# Altium schematic sheet IO_Peripherals.SchDoc
size A; SheetNumber: 7; SheetTotal: 7
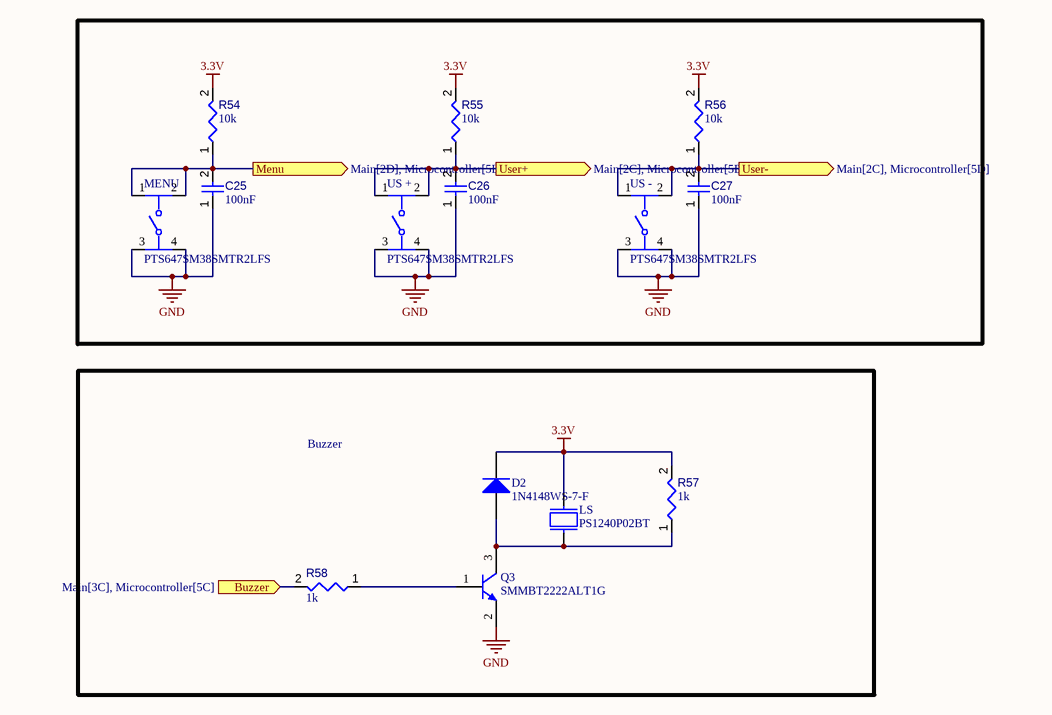
[diagram p0: IO_Peripherals.SchDoc]

## Parts
C25  value 100nF  [CAPC2013X95X50LL10T25]  (hidden comment: Capacitor 100 nF +/-10% 50 V 0805)
C26  value 100nF  [CAPC2013X95X50LL10T25]  (hidden comment: Capacitor 100 nF +/-10% 50 V 0805)
C27  value 100nF  [CAPC2013X95X50LL10T25]  (hidden comment: Capacitor 100 nF +/-10% 50 V 0805)
D2  1N4148WS-7-F  [DIOD-SOD323-2-A_V]
LS  PS1240P02BT  [XDCR_PS1240P02BT]
MENU  PTS647SM38SMTR2LFS  [FP-PTS647SM38SMTR2LFS-MFG]
Q3  SMMBT2222ALT1G  [ONSC-SOT-23-3-318-08_V]
R54  value 10k  [RESC2013X50X35ML15T15]  (hidden comment: Resistor 10k +/-1% 0805 125 mW)
R55  value 10k  [RESC2013X50X35ML15T15]  (hidden comment: Resistor 10k +/-1% 0805 125 mW)
R56  value 10k  [RESC2013X50X35ML15T15]  (hidden comment: Resistor 10k +/-1% 0805 125 mW)
R57  value 1k  [RESC0805(2012)_L]  (hidden comment: Resistor 1K +/-5% 0805 125 mW)
R58  value 1k  [RESC0805(2012)_L]  (hidden comment: Resistor 1K +/-5% 0805 125 mW)
US_+  PTS647SM38SMTR2LFS  [FP-PTS647SM38SMTR2LFS-MFG]
US_-  PTS647SM38SMTR2LFS  [FP-PTS647SM38SMTR2LFS-MFG]

## Blocks framed on the sheet
Buzzer: D2 LS Q3 R57 R58

## Ports
Buzzer (in, see Main[3C], Microcontroller[5C]), Menu (out, see Main[2D], Microcontroller[5D]), User+ (out, see Main[2C], Microcontroller[5D]), User- (out, see Main[2C], Microcontroller[5D])

## Nets
3.3V: D2.2(K) LS.2 R54.2 R55.2 R56.2 R57.2
GND: C25.1 C26.1 C27.1 MENU.3 MENU.4 Q3.2(E) US_+.3 US_+.4 US_-.3 US_-.4
Buzzer: R58.2 ; port Buzzer
Menu: C25.2 MENU.1 MENU.2 R54.1 ; port Menu
User+: C26.2 R55.1 US_+.1 US_+.2 ; port User+
User-: C27.2 R56.1 US_-.1 US_-.2 ; port User-
NetD2_1: D2.1(A) LS.1 Q3.3(C) R57.1
NetQ3_1: Q3.1(B) R58.1

## Library data of the parts
C25-C27 = CMP-001-00018-6: Chip Capacitor, 100 nF, +/- 10%, 50 V, 0805 (2012 Metric); Capacitor Type: Ceramic; Voltage Rating: 50V; Pins: 2; Max Operating Temperature: 125°C; Min Operating Temperature: -55°C; Mounting Technology: SM; Case/Package: 0805; RoHS Compliant: True; Tolerance: 10%
D2 = CMP-004-00034-1: Rectifier Diode Small Signal Switching 75V 0.3A 4ns 2-Pin SOD-323 T/R; Max Surge Current: 2A; Forward Voltage: 715mV; Max Operating Temperature: 150°C; Mounting Technology: Surface Mount; Pins: 2; Min Operating Temperature: -65°C
LS = CMP-025-000000-1: Buzzers Transducer, Externally Driven Piezo 3V 4kHz 60dB @ 3V, 10cm Through Hole PC Pins; MF: TDK; Availability: Unavailable; Value: *; MP: PS1240P02BT; Price: None; Component Type: Standard; Package: 2020 TDK; SnapEDA_Link: https://www.snapeda.com/parts/PS1240P02BT/TDK/view-part/53420/?ref=snap; Design Item ID: PS1240P02BT; Pin Count: 2; Source: SnapEDAsch.SchLib; Manufacturer Part Number 1: PS1240P02BT
MENU US_+ US_- = CMP-011-00014-1: Switch Tactile OFF Mom SPST Round Button Gull Wing 50mA 12VDC 100000Cycles 1.77N Surface Mount T/R; Mounting Technology: Surface Mount; Max Operating Temperature: 70°C; Min Operating Temperature: -40°C; Max Current Rating: 50mA; Throw Configuration: SPST
Q3 = CMP-1048-00591-1: General Purpose Transistor, NPN Silicon, 3-Pin SOT-23, Pb-Free, Tape and Reel; Manufacturer: On Semiconductor; fT Min (MHz): 300; IC Continuous (A): 0.6; Mounting Technology: Surface Mount; ComponentLink1URL: http://www.onsemi.com/; Polarity: NPN; PackageDescription: 3-Pin Small Outline Transistor, Body 2.92 x 1.3 mm, Pitch 0.95 mm; RoHS: TRUE; DatasheetVersion: Rev. 10; Packing: Tape and Reel; PackageVersion: Rev. AP, 11/2009; ComponentLink3Description: Package Specification; PartNumber: SMMBT2222ALT1G; ComponentLink1Description: Manufacturer URL; ComponentLink3URL: http://www.onsemi.cn/pub_link/Collateral/318-08.PDF; PackageReference: SOT-23-3-318-08; ComponentLink2Description: Datasheet; ComponentLink2URL: http://www.onsemi.cn/pub_link/Collateral/MMBT2222LT1-D.PDF
R54-R56 = CMP-009-00018-5: Chip Resistor, 10 KOhm, +/- 1%, 125 mW, -55 to 155 degC, 0805 (2012 Metric); Power: 125mW; Voltage Rating: 150V; Tolerance: 1%; Pins: 2; Min Operating Temperature: -55°C; Case/Package: 0805; Max Operating Temperature: 155°C; RoHS Compliant: True; Mounting Technology: SM
R57 R58 = CMP-009-00118-3: Chip Resistor, 1 kOhms, +/-5%, 125 mW, -55 to 155 degC, 0805; Tolerance: 5%; Power: 125mW; Case/Package: 0805; Pins: 2; Min Operating Temperature: -55°C; Max Operating Temperature: 155°C